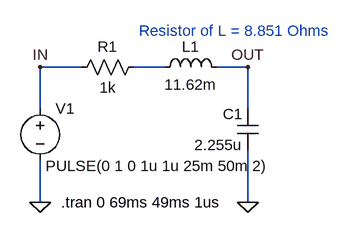
[diagram p0: schematic 1-3-1_RLC_overdamped.asc]
1-3-1_RLC_overdamped.asc, the LTspice schematic file:
Version 4.1
SHEET 1 880 680
WIRE -64 48 -128 48
WIRE 64 48 16 48
WIRE 192 48 144 48
WIRE -128 112 -128 48
WIRE 192 112 192 48
WIRE -128 256 -128 192
WIRE 192 256 192 176
FLAG 192 256 0
FLAG -128 256 0
FLAG -128 48 IN
FLAG 192 48 OUT
SYMBOL res -80 64 R270
WINDOW 0 32 56 VTop 2
WINDOW 3 0 56 VBottom 2
SYMATTR InstName R1
SYMATTR Value 1k
SYMBOL cap 208 176 R180
WINDOW 0 24 56 Left 2
WINDOW 3 24 8 Left 2
SYMATTR InstName C1
SYMATTR Value 2.255u
SYMBOL voltage -128 96 R0
WINDOW 3 8 104 Left 2
WINDOW 123 0 0 Left 0
WINDOW 39 0 0 Left 0
SYMATTR Value PULSE(0 1 0 1u 1u 25m 50m 2)
SYMATTR InstName V1
SYMBOL ind 48 64 R270
WINDOW 0 32 56 VTop 2
WINDOW 3 5 56 VBottom 2
SYMATTR InstName L1
SYMATTR Value 11.62m
SYMATTR SpiceLine Rser=8.851
TEXT -96 256 Left 2 !.tran 0 69ms 49ms 1us
TEXT 24 -8 Left 2 ;Resistor of L = 8.851 Ohms

The netlist it stands for:
* 1-3-1_RLC_overdamped.asc
R1 IN N001 1k
C1 0 OUT 2.255u
V1 IN 0 PULSE(0 1 0 1u 1u 25m 50m 2)
L1 N001 OUT 11.62m Rser=8.851
.tran 0 69ms 49ms 1us
* Resistor of L = 8.851 Ohms
.backanno
.end